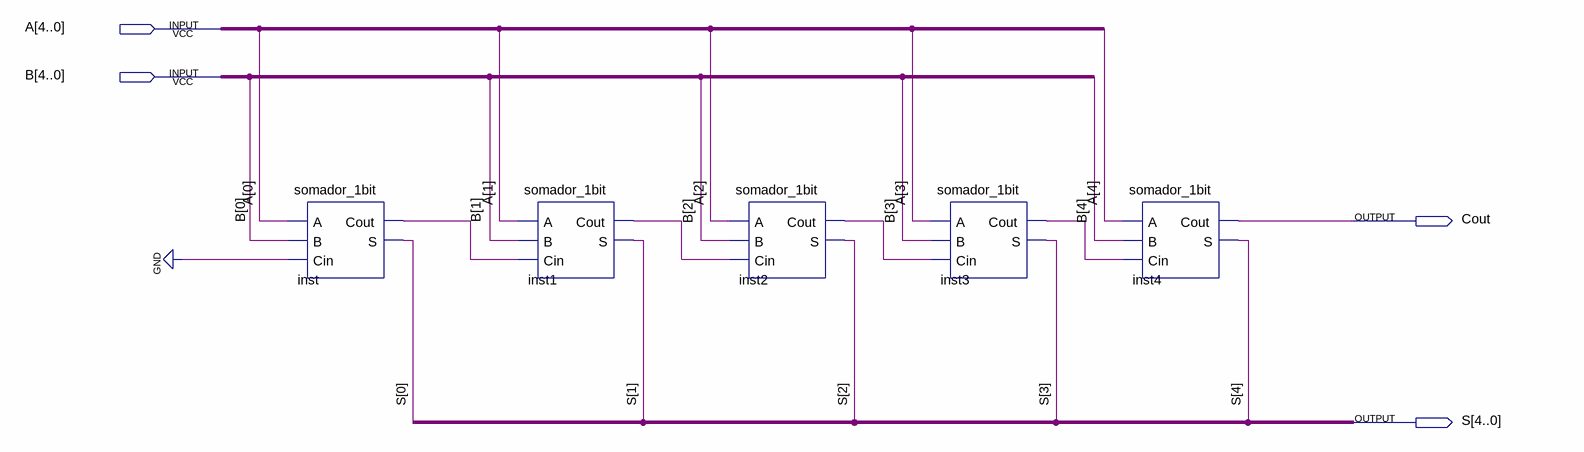
[diagram p0: schematic sheet]
// Quartus schematic somador_5bit.bdf as structural Verilog: 5 symbols, 4 pins
module somador_5bit (
  input  [4:0] A,
  input  [4:0] B,
  output Cout,
  output [4:0] S
);

  wire inst1_cout, inst2_cout, inst3_cout, inst_cout;

  somador_1bit inst (.A(A[0]), .B(B[0]), .Cin(1'b0), .Cout(inst_cout), .S(S[0]));
  somador_1bit inst1 (.A(A[1]), .B(B[1]), .Cin(inst_cout), .Cout(inst1_cout), .S(S[1]));
  somador_1bit inst2 (.A(A[2]), .B(B[2]), .Cin(inst1_cout), .Cout(inst2_cout), .S(S[2]));
  somador_1bit inst3 (.A(A[3]), .B(B[3]), .Cin(inst2_cout), .Cout(inst3_cout), .S(S[3]));
  somador_1bit inst4 (.A(A[4]), .B(B[4]), .Cin(inst3_cout), .Cout(Cout), .S(S[4]));
endmodule
